# EAGLE design ASD2022 (EAGLE 6.3)
DATABASE: ./../../../../../Components/TinyCircuits_Part_Database.txt
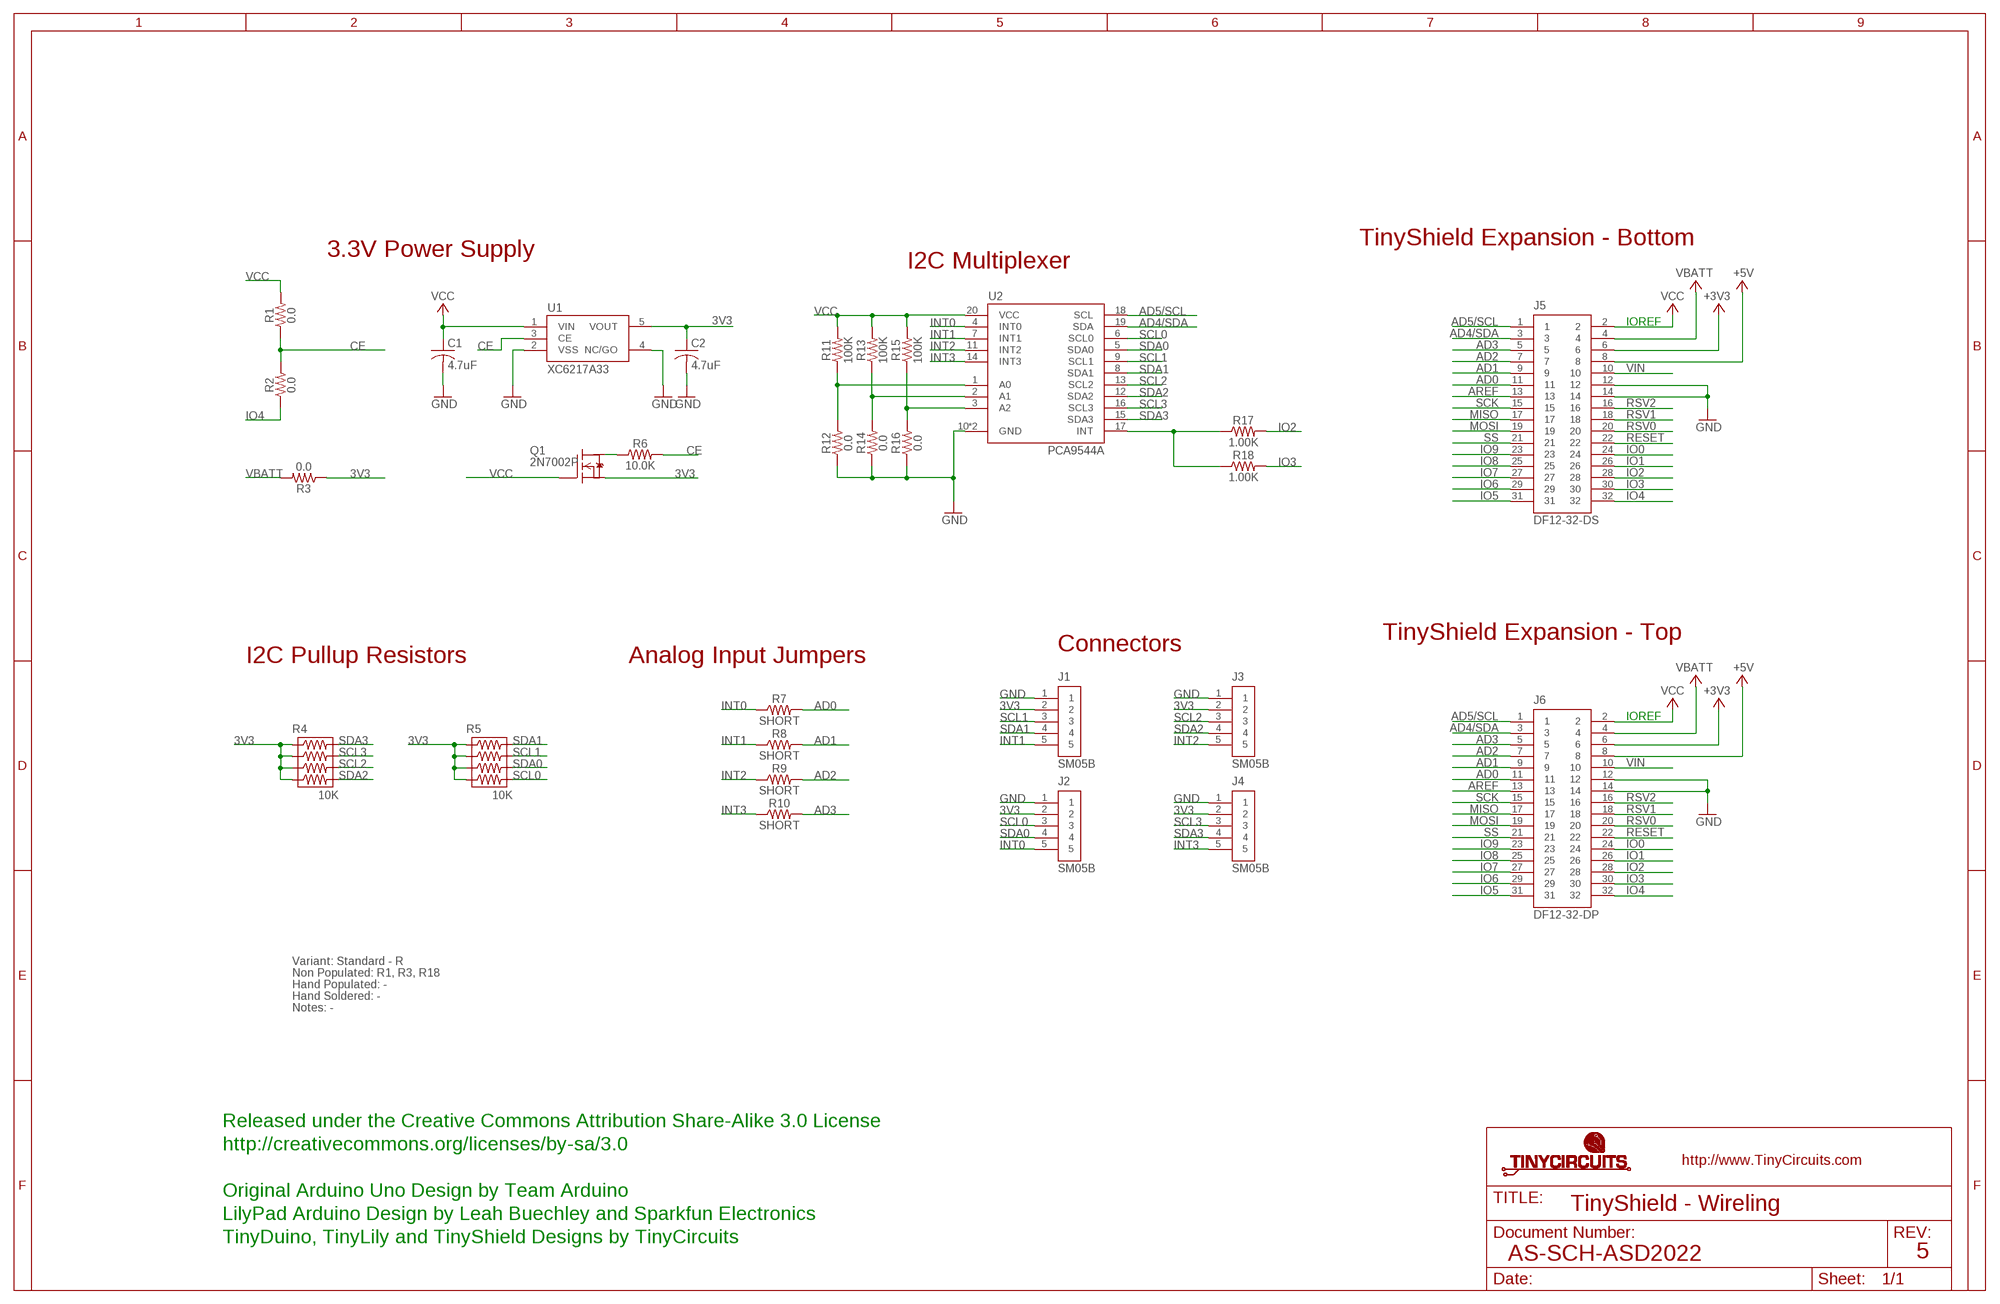
[diagram p0: schematic, sheet 1]

## Parts
C1  4.7uF  AS-ITM-00242  [C0402]
C2  4.7uF  AS-ITM-00242  [C0402]
J1  SM05B  AS-ITM-00340EDGE  [JST_SH_5X1_EDGE]
J2  SM05B  AS-ITM-00340EDGE  [JST_SH_5X1_EDGE]
J3  SM05B  AS-ITM-00340EDGE  [JST_SH_5X1_EDGE]
J4  SM05B  AS-ITM-00340EDGE  [JST_SH_5X1_EDGE]
J5  DF12-32-DS  AS-ITM-00012  [DF12-32-DS]
J6  DF12-32-DP  AS-ITM-00015  [DF12-32-DP]
Q1  2N7002P  AS-ITM-00110  [SOT-416]
R1  0.0  AS-ITM-00076  [0402]
R2  0.0  AS-ITM-00076  [0402]
R3  0.0  AS-ITM-00076  [0402]
R4  10K  AS-ITM-00520  [0402RPACK]
R5  10K  AS-ITM-00520  [0402RPACK]
R6  10.0K  AS-ITM-00032  [0402]
R7  SHORT  AS-ITM-000760402_SHORT  [0402_SHORT]
R8  SHORT  AS-ITM-000760402_SHORT  [0402_SHORT]
R9  SHORT  AS-ITM-000760402_SHORT  [0402_SHORT]
R10  SHORT  AS-ITM-000760402_SHORT  [0402_SHORT]
R11  100K  AS-ITM-00004  [0402]
R12  0.0  AS-ITM-00076  [0402]
R13  100K  AS-ITM-00004  [0402]
R14  0.0  AS-ITM-00076  [0402]
R15  100K  AS-ITM-00004  [0402]
R16  0.0  AS-ITM-00076  [0402]
R17  1.00K  AS-ITM-00003  [0402]
R18  1.00K  AS-ITM-00003  [0402]
U1  XC6217A33  AS-ITM-00249  [SOT-25]
U2  PCA9544A  AS-ITM-00342  [VQFN-20_4.5X3.5]

## Nets
3V3: C2.1 J1.2 J2.2 J3.2 J4.2 Q1.2(S) R3.1 R4.1 R4.3 R4.5 R4.7 R5.1 R5.3 R5.5 R5.7 U1.5(VOUT)
+3V3: J5.6 J6.6
+5V: J5.8 J6.8
AD0: J5.11 J6.11 R7.2
AD1: J5.9 J6.9 R8.2
AD2: J5.7 J6.7 R9.2
AD3: J5.5 J6.5 R10.2
AD4/SDA: J5.3 J6.3 U2.19(SDA)
AD5/SCL: J5.1 J6.1 U2.18(SCL)
AREF: J5.13 J6.13
CE: R1.1 R2.2 R6.2 U1.3(CE)
GND: C1.2 C2.2 J1.1 J2.1 J3.1 J4.1 J5.12 J5.14 J6.12 J6.14 R12.1 R14.1 R16.1 U1.2(VSS) U1.4(NC/GO) U2.10(GND) U2.PAD(GND)
INT0: J2.5 R7.1 U2.4(INT0)
INT1: J1.5 R8.1 U2.7(INT1)
INT2: J3.5 R9.1 U2.11(INT2)
INT3: J4.5 R10.1 U2.14(INT3)
IO0: J5.24 J6.24
IO1: J5.26 J6.26
IO2: J5.28 J6.28 R17.2
IO3: J5.30 J6.30 R18.2
IO4: J5.32 J6.32 R2.1
IO5: J5.31 J6.31
IO6: J5.29 J6.29
IO7: J5.27 J6.27
IO8: J5.25 J6.25
IO9: J5.23 J6.23
MISO: J5.17 J6.17
MOSI: J5.19 J6.19
N$1: Q1.3(D) R6.1
N$2: R11.1 R12.2 U2.1(A0)
N$3: R15.1 R16.2 U2.3(A2)
N$4: R17.1 R18.1 U2.17(INT)
N$6: R13.1 R14.2 U2.2(A1)
RESET: J5.22 J6.22
RSV0: J5.20 J6.20
RSV1: J5.18 J6.18
RSV2: J5.16 J6.16
SCK: J5.15 J6.15
SCL0: J2.3 R5.8 U2.6(SCL0)
SCL1: J1.3 R5.4 U2.9(SCL1)
SCL2: J3.3 R4.6 U2.13(SCL2)
SCL3: J4.3 R4.4 U2.16(SCL3)
SDA0: J2.4 R5.6 U2.5(SDA0)
SDA1: J1.4 R5.2 U2.8(SDA1)
SDA2: J3.4 R4.8 U2.12(SDA2)
SDA3: J4.4 R4.2 U2.15(SDA3)
SS: J5.21 J6.21
VBATT: J5.4 J6.4 R3.2
VCC: C1.1 J5.2 J6.2 Q1.1(G) R1.2 R11.2 R13.2 R15.2 U1.1(VIN) U2.20(VCC)
VIN: J5.10 J6.10

## Notes on the sheet
- TinyShield Expansion - Bottom
- 3.3V Power Supply
- I2C Multiplexer
- IOREF
- TinyShield Expansion - Top
- Connectors
- I2C Pullup Resistors | Analog Input Jumpers
- IOREF
- Variant: Standard - R
- Non Populated: R1, R3, R18
- Hand Populated: -
- Hand Soldered: -
- Notes: -
- Released under the Creative Commons Attribution Share-Alike 3.0 License
- http://creativecommons.org/licenses/by-sa/3.0
- Original Arduino Uno Design by Team Arduino
- TinyShield - Wireling
- LilyPad Arduino Design by Leah Buechley and Sparkfun Electronics
- TinyDuino, TinyLily and TinyShield Designs by TinyCircuits
- AS-SCH-ASD2022 | 5

## Library data of the parts
C1 C2 = tinycircuits:AS-ITM-00242: CAP CER 4.7UF 6.3V 20% X5R 0402; PARTNO: AS-ITM-00242
J1-J4 = tinycircuits:AS-ITM-00340: CONN HEADER SH 5POS SIDE 1MM TIN; PARTNO: AS-ITM-00340; PNPROTATION: 180
J5 = tinycircuits:AS-ITM-00012: CONN RECEPT 32POS 3MM SMD 0.5MM; PARTNO: AS-ITM-00012; PNPROTATION: 0
J6 = tinycircuits:AS-ITM-00015: CONN HEADER 32POS 3MM SMD 0.5MM; PARTNO: AS-ITM-00015; PNPROTATION: 0
Q1 = tinycircuits:AS-ITM-00110: MOSFET N-CH SGL 60V SOT-416; PARTNO: AS-ITM-00110; VALUE: 2N7002PT
R1-R3 R7-R10 R12 R14 R16 = tinycircuits:AS-ITM-00076: RES 0.0 OHM 1/16W 1% 0402 SMD; PARTNO: AS-ITM-00076
R4 R5 = tinycircuits:AS-ITM-00520: RES ARRAY 4 RES 10K OHM 0804; PARTNO: AS-ITM-00520
R6 = tinycircuits:AS-ITM-00032: RES 10.0K OHM 1/16W 1% 0402 SMD; PARTNO: AS-ITM-00032
R11 R13 R15 = tinycircuits:AS-ITM-00004: RES 100K OHM 1/16W 1% 0402; PARTNO: AS-ITM-00004
R17 R18 = tinycircuits:AS-ITM-00003: RES 1.00K OHM 1/16W 1% 0402; PARTNO: AS-ITM-00003
U1 = tinycircuits:AS-ITM-00249: IC REG LDO 3.3V 0.2A SOT25; PARTNO: AS-ITM-00249; PNPROTATION: 270
U2 = tinycircuits:AS-ITM-00342: IC I2C MUX 4CH BI-DIR 20-VQFN; PARTNO: AS-ITM-00342

## Board
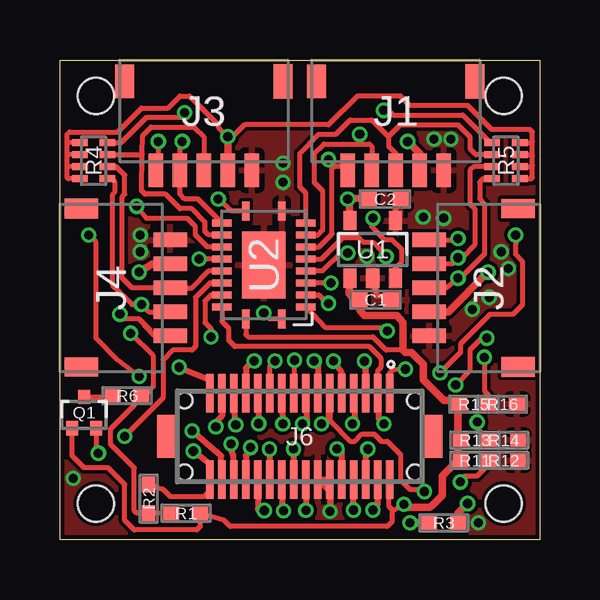
[diagram p1: board, top side]
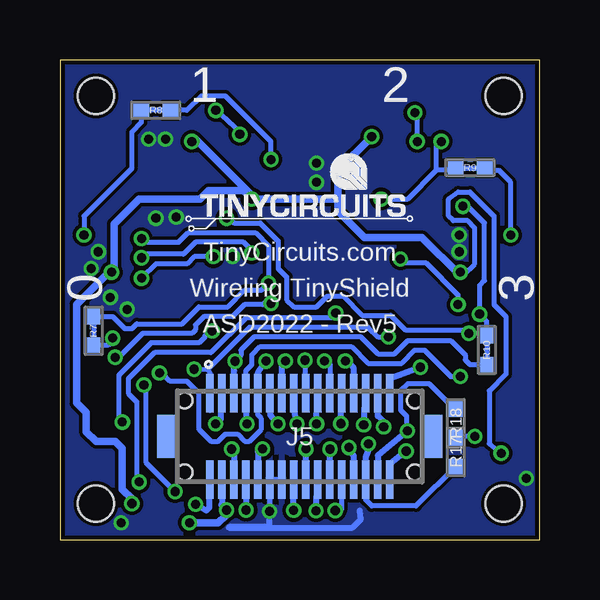
[diagram p2: board, bottom side, seen from below]

Size 20 x 20 mm. Coordinates in mm from the lower left corner, seen from the top.
Outline: 0,20 20,20 20,0 0,0 0,20
Copper layers (1*16): Top 0.035mm / dielectric 1.5mm / Bottom 0.035mm
Design rules "default *": minimum track width 5mil, minimum drill 15mil, track to track 6mil, track to pad 6mil, pad to pad 6mil, via to via 6mil, smd to smd 6mil, copper to edge 7mil, drill to drill 8mil, minimum pad ring 10mil, minimum via ring 5mil, stop-mask expansion 4mil, vias tented up to drill 25mil, thermal gap 10mil
Holes 1.5 mm at 1.5,18.5 18.5,18.5 18.5,1.5 1.5,1.5

### Footprints (pad centres in the part's own frame; a part is rotated, then mirrored left to right if it is on the bottom)
C0402 = smd 0.65 x 0.6: 1 -0.65,0; 2 0.65,0
JST_SH_5X1_EDGE = smd 0.6 x 1.4: 1 -2,2.475; 2 -1,2.475; 3 0,2.475; 4 1,2.475; 5 2,2.475 | smd 0.8 x 1.4: PAD1 -3.3,-1.225; PAD2 3.3,-1.225
DF12-32-DS = smd 0.3 x 1.6: 1 -3.75,1.8; 2 -3.75,-1.8; 3 -3.25,1.8; 4 -3.25,-1.8; 5 -2.75,1.8; 6 -2.75,-1.8; 7 -2.25,1.8; 8 -2.25,-1.8; 9 -1.75,1.8; 10 -1.75,-1.8; 11 -1.25,1.8; 12 -1.25,-1.8; 13 -0.75,1.8; 14 -0.75,-1.8; 15 -0.25,1.8; 16 -0.25,-1.8; 17 0.25,1.8; 18 0.25,-1.8; 19 0.75,1.8; 20 0.75,-1.8; 21 1.25,1.8; 22 1.25,-1.8; 23 1.75,1.8; 24 1.75,-1.8; 25 2.25,1.8; 26 2.25,-1.8; 27 2.75,1.8; 28 2.75,-1.8; 29 3.25,1.8; 30 3.25,-1.8; 31 3.75,1.8; 32 3.75,-1.8 | smd 0.9 x 1.8: F1 -5.5,0; F2 5.5,0 | hole 0.65: -4.8,1.5; 4.8,1.5
DF12-32-DP = smd 0.3 x 1.6: 1 -3.75,-1.8; 2 -3.75,1.8; 3 -3.25,-1.8; 4 -3.25,1.8; 5 -2.75,-1.8; 6 -2.75,1.8; 7 -2.25,-1.8; 8 -2.25,1.8; 9 -1.75,-1.8; 10 -1.75,1.8; 11 -1.25,-1.8; 12 -1.25,1.8; 13 -0.75,-1.8; 14 -0.75,1.8; 15 -0.25,-1.8; 16 -0.25,1.8; 17 0.25,-1.8; 18 0.25,1.8; 19 0.75,-1.8; 20 0.75,1.8; 21 1.25,-1.8; 22 1.25,1.8; 23 1.75,-1.8; 24 1.75,1.8; 25 2.25,-1.8; 26 2.25,1.8; 27 2.75,-1.8; 28 2.75,1.8; 29 3.25,-1.8; 30 3.25,1.8; 31 3.75,-1.8; 32 3.75,1.8 | smd 0.9 x 1.8: F1 -5.5,0; F2 5.5,0 | hole 0.65: -4.8,1.5; 4.8,1.5
SOT-416 = smd 0.5 x 0.6: 1 -0.5,-0.65; 2 0.5,-0.65; 3 0,0.65
0402 = smd 0.65 x 0.55: 1 -0.6,0; 2 0.6,0
0402RPACK = smd 0.3 x 0.65: 1 -0.75,0.575; 2 -0.75,-0.575; 3 -0.25,0.575; 4 -0.25,-0.575; 5 0.25,0.575; 6 0.25,-0.575; 7 0.75,0.575; 8 0.75,-0.575
0402_SHORT = smd 0.65 x 0.55: 1 -0.6,0; 2 0.6,0
SOT-25 = smd 0.55 x 0.8: 1 -0.95,-1.2; 2 0,-1.2; 3 0.95,-1.2; 4 0.95,1.2; 5 -0.95,1.2
VQFN-20_4.5X3.5 = smd 0.8 x 0.3: 1 -2.25,-0.75; 10 2.25,-0.75; 11 2.25,0.75; 20 -2.25,0.75 | smd 0.3 x 0.8: 2 -1.75,-1.75; 3 -1.25,-1.75; 4 -0.75,-1.75; 5 -0.25,-1.75; 6 0.25,-1.75; 7 0.75,-1.75; 8 1.25,-1.75; 9 1.75,-1.75; 12 1.75,1.75; 13 1.25,1.75; 14 0.75,1.75; 15 0.25,1.75; 16 -0.25,1.75; 17 -0.75,1.75; 18 -1.25,1.75; 19 -1.75,1.75 | smd 2.8 x 1.8: PAD 0,0

### Placement (x,y rotation side)
C1  13.15,10 0 top
C2  13.55,14.2 0 top
J1  14,17.88 180 top
J2  17.88,10.5 90 top
J3  6,17.88 180 top
J4  2.12,10.5 270 top
J5  10,4.3 0 bottom
J6  10,4.3 180 top
Q1  1,5.3 0 top
R1  5.25,1.1 0 top
R2  3.7,1.7 270 top
R3  16,0.7 180 top
R4  1.4,15.8 90 top
R5  18.6,15.8 270 top
R6  2.8,6 0 top
R7  18.6,8.7 270 bottom
R8  16,17.9 180 bottom
R9  2.9,15.5 0 bottom
R10  2.2,7.9 270 bottom
R11  17.3,3.3 180 top
R12  18.5,3.3 180 top
R13  17.3,4.15 180 top
R14  18.5,4.15 180 top
R15  17.25,5.65 180 top
R16  18.45,5.65 180 top
R17  3.5,3.65 270 bottom
R18  3.5,4.85 90 bottom
U1  13.04,12.1 0 top
U2  8.5,11.45 90 top
U$1  [DOCFIELD-TINYCIRCUITS-PCB]  33.91,-10 0 top  (outside the outline)

### Tracks (layer width: path | path; a pad name or v marks a point on that pad's centre or on a via)
3V3  (via drill 0.38)
  Top 0.203: R4.1 0.35,15.05 0.3,15.1 0.3,15.5 | 0.3,15.5 0.3,16 | 0.3,16 0.3,16.5 | R4.7 0.35,16.55 0.3,16.5 | R4.5 0.35,16.05 0.3,16 | R4.3 0.35,15.55 0.3,15.5 | 0.3,16.5 0.3,16.9 0.4,17 2.4,17 3.4,18 4.5,18 5,18.5 5.4,18.5 6.6,17.3 6.6,17.2 v7,16.8 7.2,16.8 7.7,17.3 11.2,17.3 12.4,18.5 14.2,18.5 14.6,18.1 17,18.1 18,17.1 19.6,17.1 19.7,17 19.7,16.6 | R5.7 19.65,15.05 19.7,15.1 19.7,15.6 | 19.7,15.6 19.7,16 | 19.7,16 19.7,16.6 | R5.5 19.65,15.55 19.7,15.6 | R5.3 19.65,16.05 19.7,16 | R5.1 19.65,16.55 19.7,16.6 | Q1.2 1.5,3.7 v1.6,3.6
  Top 0.305: U1.5 12.04,14.16 v12,14.2 12.05,14.25 C2.1 | v3.3,11.15 3.85,11.5 J4.2 | v7,16.8 J3.2 | J1.2 15,16.1 v14.5,16.6 | J2.2 16.2,9.5 v17.85,11.15 | R3.1 16.6,1.1 v17,1.5
  Bottom 0.203: 3.35,11.05 3.15,11.05 2.7,11.5 2.7,13 3,13.3 3.6,13.3 3.8,13.5 3.8,14.2 3.4,14.5 2.9,14.5 1.9,13.5 1.9,9.8 1.4,9.3 1.4,6.9 2.1,6.2 2.1,4 v1.6,3.6
  Bottom 0.305: v12,14.2 8.4,14.2 | 8.4,14.2 8.4,13.7 7.3,12.6 4.9,12.6 3.35,11.05 v3.3,11.15 | 8.4,14.2 8.4,15.4 v7,16.8 | v14.5,16.6 14.55,16.65 14.3,16.65 12,14.35 v12,14.2 | v17.85,11.15 17.8,11.1 17.75,11.15 | v17.85,11.15 17.75,11.15 | 17.75,11.15 17.75,13.15 16.7,14.2 14.15,14.2 13.8,14.55 12.35,14.55 v12,14.2 | v17,1.5 17,1.7 17.4,2.1 17.4,3.8 17.7,4.1 18.5,4.1 18.9,4.5 18.9,5.3 19.3,5.7 19.3,9.8 18.05,11.05 v17.85,11.15
+3V3  (via drill 0.38)
  Top 0.254: J5.6 12.75,3.77 v12.84,3.77
  Bottom 0.254: v12.84,3.77 12.8,3.7 12.74,3.64 12.74,2.51 J5.6
+5V  (via drill 0.38)
  Top 0.254: v12.24,1.23 J5.8
  Bottom 0.254: J5.8 12.25,1.21 v12.24,1.23
AD0  (via drill 0.38)
  Top 0.203: J5.11 11.25,4.95 12.1,4.1 12.3,4.1 12.6,4.4 13.1,4.4 13.4,4.1 13.65,4.1 14.2,3.55 14.2,2.5 14.6,2.1 15.1,2.1 | 15.15,2.1 15.1,2.1 | 15.1,2.1 v15.2,2 | v16.5,6.45 17.1,7.05 17.1,7.9 17.6,8.4 v17.8,8.4
  Top 0.254: v10.9,4.83 11.21,5.05 J5.11
  Bottom 0.203: v15.2,2 16.4,3.2 16.4,6.4 | 16.4,6.6 16.4,6.4 | 16.4,6.4 v16.5,6.45 | v17.8,8.4 17.8,8.3 18,8.1 R7.2
  Bottom 0.254: J5.11 11.23,5.79 11.23,5.18 11,4.9 v10.9,4.83
AD1  (via drill 0.38)
  Top 0.203: v15.85,6.95 16.7,7.8 16.7,8.15 17.95,9.4 18.9,9.4 19.3,9.8 19.3,11.6 19,11.9 v19,12.7 19,12.3
  Top 0.254: J5.9 11.74,6.97 v11.41,7.44
  Bottom 0.203: J5.9 11.75,5.2 11.6,5.05 11.6,4.6 12.1,4.1 12.3,4.1 12.6,4.4 13.1,4.4 13.4,4.1 13.7,4.1 14.2,4.6 14.2,6.1 14.7,6.6 15.4,6.6 15.75,6.95 v15.85,6.95 | v19,12.7 19,13.5 17,15.5 17,17 16.6,17.4 R8.2
  Bottom 0.254: v11.41,7.44 11.73,6.97 J5.9
AD2  (via drill 0.38)
  Top 0.203: v3.3,6.8 2.4,7.5 1.5,8.4 1.5,12.4 v1.2,12.7
  Top 0.254: v12.19,4.83 12.31,5.05 J5.7
  Bottom 0.203: J5.7 12.25,7.05 12,7.3 12,7.7 11.65,8.05 7.85,8.05 7.15,7.35 5.75,7.35 5.2,7.9 4.8,7.9 3.7,6.8 v3.3,6.8 | v1.2,12.7 1.2,14.9 1.7,15.4 2.2,15.4 R9.2
  Bottom 0.254: J5.7 12.27,5.86 v12.19,4.83
AD3  (via drill 0.38)
  Top 0.254: J5.5 12.73,7.04 v12.7,7.44
  Bottom 0.203: v12.7,7.44 12.45,7.68 12.45,7.9 11.9,8.45 7.45,8.45 6.75,7.75 6.05,7.75 5.5,8.3 3.7,8.3 3.1,7.7 3.1,7.5 2.9,7.3 R10.2
  Bottom 0.254: v12.7,7.44 12.73,7.05 J5.5
AD4/SDA  (via drill 0.38)
  Top 0.203: U2.19 6.75,9.1 7.05,8.8 7.05,8.3 7.3,8.05 12.9,8.05 13.4,7.55 13.4,7.2 13.25,7.05 J5.3
  Top 0.254: v13.51,4.83 13.31,5 J5.3
  Bottom 0.254: J5.3 13.28,5.86 13.28,5.02 13.4,4.9 v13.51,4.83
AD5/SCL  (via drill 0.38)
  Top 0.203: 13.75,5.37 J5.1 13.75,6.95 13.9,7.1 v14.41,7.11 | U2.18 6.3,10.2 6.05,9.95 6.05,9.05 6.3,8.8 v6.3,8.45
  Bottom 0.203: v14.41,7.11 13.85,7.1 | 13.85,7.1 13.75,6.95 J5.1 | 13.75,5.37 J5.1 | J5.1 | v6.3,8.45 6.75,8.45 7.15,8.85 12.1,8.85 13.85,7.1
AREF  (via drill 0.38)
  Top 0.254: v10.6,7.45 10.7,7.4 10.75,7.35 J5.13
  Bottom 0.254: J5.13 10.75,7.35 10.7,7.4 v10.6,7.45
CE  (via drill 0.38)
  Top 0.203: U1.3 13.99,11.34 14.25,11.6 14.25,12.1 13.85,12.5 13.55,12.5 13,13.05 v13.05,13.4 | R1.1 R2.2 3.2,1.1 3.1,1.2 3.1,3 2.1,4 2.1,4.6 3.1,5.6 3.1,5.7 R6.2 3.5,6 3.9,6.4 3.9,7.65 v2.95,8.6 3.1,8.45
  Bottom 0.203: v13.05,13.4 12.85,13.3 12.75,13.2 11.65,13.2 10.9,12.45 10.9,11.3 10.55,10.95 10.55,10 10.25,9.7 9.3,9.7 8.85,10.15 8.2,10.15 7.4,9.35 6.2,9.35 5.6,8.75 3.15,8.75 3,8.6 v2.95,8.6
GND  (via drill 0.38)
  Top 0.203: J5.12 v11.26,1.17 | 11.3,1.95 11.3,1.14 | 11.3,1.14 11.29,1.13 11.29,1.09 | J5.14 11.27,1.97 11.27,1.93 11.22,1.87 11.27,1.16 11.28,1.07 11.28,1.03 11.3,1.01 11.37,1.01 | 11.3,1.14 11.3,1.01 | U1.4 13.94,13.64 14,13.7 14.05,14 C2.2 | C1.2 13.65,10.15 13.2,10.15 13.2,10.4 13.04,10.56 U1.2
  Top 0.254: J5.12 J5.14
  Bottom 0.203: v11.26,1.17 11.25,1.21 J5.12
  Bottom 0.254: J5.12 J5.14 | 7.5,1.2 7.45,0.85 7.8,0.5 12.95,0.5 12.9,0.55 11.25,0.55 11.26,0.56 v11.26,1.17
  other vias: 17.45,0.7 0.55,2.55 3.35,12.7 3.35,12 17.2,9.6 15.6,16.7 12.8,11.8 16.3,16.7 15.15,13.45 16,13.4 9.3,14.9 9.3,15.7 18.7,11.3 18.4,12 17.9,10.1
  pour Top: 0,0 20,0 20,20 0,20
  pour Bottom: 0,20 20,20 20,0 0,0
INT0  (via drill 0.38)
  Top 0.203: J2.5 16.5,12.5 v16.6,12.55 | v11.3,10.7 U2.4
  Bottom 0.203: v16.6,12.55 16.55,12.55 16.4,12.4 15.05,12.4 14.65,12.8 11.85,12.8 11.3,12.25 v11.3,10.7 11.6,10.4 12.3,10.4 13,9.7 14.2,9.7 14.9,9 16.8,9 17,8.8 17.3,8.8 17.8,9.3 R7.1
INT1  (via drill 0.38)
  Top 0.203: U2.7 10.8,12.2 11.35,12.75 11.35,15.65 | J1.5 11.85,15.55 11.45,15.55 11.35,15.65 | 11.35,15.65 11.2,15.8 v11.2,15.85 11.35,15.65
  Bottom 0.203: v11.2,15.85 11.2,16.6 13.1,18.5 14.1,18.5 14.7,17.9 R8.1
INT2  (via drill 0.38)
  Top 0.203: U2.11 7.15,13.7 v6.6,14.2 | v4.1,16.6 4.1,15.5 J3.5
  Bottom 0.203: v6.6,14.2 5.5,14.2 4.3,15.4 | 4.3,15.4 4.3,16.4 v4.1,16.6 | R9.1 3.6,15.4 4.3,15.4
INT3  (via drill 0.38)
  Top 0.203: U2.14 6.15,12.2 5.65,12.7 5.65,13.05 5.3,13.4 3.6,13.4 v3.2,13.9 | J4.5 3.95,8.5 3.55,8.9 3.75,8.75 3.3,9.2 2.7,9.2 v2.5,9.4
  Bottom 0.203: 3.3,13.8 v3.2,13.9 3.1,14 2.3,13.2 2.3,10.8 2.5,10.6 v2.5,9.4 2.2,9.1 R10.1
IO0  (via drill 0.38)
  Top 0.254: J5.24 8.25,1.26 v8.52,1.21
  Bottom 0.203: v8.52,1.21 8.48,1.27 8.25,1.27 J5.24
  Bottom 0.254: J5.24
IO1  (via drill 0.38)
  Top 0.254: v7.95,3.84 7.95,3.7 7.75,3.5 J5.26
  Bottom 0.254: J5.26 7.75,3.5 7.95,3.7 v7.95,3.84
IO2  (via drill 0.38)
  Top 0.254: v7.13,3.99 7.07,3.89 7.22,3.49 7.29,2.61 7.26,2.51 J5.28
  Bottom 0.203: R17.2 5.15,1.4 7,1.4 7.25,1.65 J5.28
  Bottom 0.254: J5.28 7.24,3.43 7.07,3.88 v7.13,3.99
IO3  (via drill 0.38)
  Top 0.254: J5.30 6.73,3.49 v5.51,4.53
  Bottom 0.203: 5.51,4.71 v5.51,4.53 5.55,4.57 5.55,5.15 5.8,5.4 5.8,6.2 5.5,6.5 4.6,6.5 3.55,5.45 R18.2
  Bottom 0.254: v5.51,4.53 6.75,3.51 6.77,2.53 J5.30
IO4  (via drill 0.38)
  Top 0.203: R2.1 4.3,2.1 4.6,1.8 6,1.8 6.25,2.05 J5.32
  Top 0.254: J5.32 6.25,3.14 v5.56,3.69
  Bottom 0.254: v5.56,3.69 5.61,3.65 6.21,3.18 6.21,3.14 6.26,3.1 J5.32
IO5  (via drill 0.38)
  Top 0.254: v4.97,7.19 6.23,6.68 J5.31
  Bottom 0.254: J5.31 6.26,6.69 v4.97,7.19
IO6  (via drill 0.38)
  Top 0.254: J5.29 6.75,5.15 6.3,4.7 v6.5,4.7
  Bottom 0.203: 6.74,6.11 J5.29
  Bottom 0.254: v6.5,4.7 6.3,4.7 6.75,5.15 J5.29
IO7  (via drill 0.38)
  Top 0.254: v7.33,4.78 7.31,4.9 J5.27
  Bottom 0.254: J5.27 7.29,5.76 v7.33,4.78
IO8  (via drill 0.38)
  Top 0.203: 7.76,6.11 J5.25
  Top 0.254: v8.1,7.45 8,7.4 7.75,7.15 J5.25
  Bottom 0.254: J5.25 7.75,7.15 8,7.4 v8.1,7.45
IO9  (via drill 0.38)
  Top 0.254: v8.29,4.83 8.31,4.98 J5.23
  Bottom 0.254: J5.23 8.28,5.59 v8.29,4.83
MISO  (via drill 0.38)
  Top 0.203: v9.78,7.48 9.75,7.46 J5.17
  Bottom 0.203: J5.17 9.76,6.11 9.76,7.17 9.73,7.3 v9.78,7.48
MOSI  (via drill 0.38)
  Top 0.254: v9.3,4.83 9.31,4.95 J5.19
  Bottom 0.254: J5.19 9.27,5.76 v9.3,4.83
N$1
  Top 0.203: Q1.3 2.15,5.95 R6.1
N$2  (via drill 0.38)
  Top 0.203: U2.1 8.75,9.2 v8.5,9.45 | v16.7,2.4 16.9,2.65 17.4,2.65 17.9,3.15 R11.1
  Bottom 0.203: v8.5,9.45 8.65,9.25 12.25,9.25 13.7,7.8 16.05,7.8 17.15,6.7 17.15,6.1 16.8,5.75 16.8,2.5 v16.7,2.4
N$3  (via drill 0.38)
  Top 0.203: U2.3 10.8,10.2 11,10 11.05,10 v11.2,9.85 | v17.7,7.6 17.7,6.2 17.85,6.05 R15.1
  Bottom 0.203: v11.2,9.85 11.5,9.85 11.55,9.8 12.3,9.8 12.8,9.3 14,9.3 14.35,8.95 14.35,8.75 14.5,8.6 16.55,8.6 17.55,7.6 v17.7,7.6
N$4  (via drill 0.38)
  Top 0.203: U2.17 6.25,10.7 5.65,10.1 5.65,8.05 5.5,7.9 4.7,7.9 4.3,7.5 4.3,5.9 v2.7,4.3
  Bottom 0.203: v2.7,4.3 3.45,4.3 R17.1
N$6  (via drill 0.38)
  Top 0.203: U2.2 11.05,8.85 13.5,8.85 v13.65,8.7 | v17.4,4.9 17.35,4.7 R13.1
  Bottom 0.203: v13.65,8.7 13.8,8.55 13.9,8.55 13.95,8.5 13.95,8.45 14.2,8.2 16.2,8.2 17.55,6.85 17.55,5 v17.4,4.9
RESET  (via drill 0.38)
  Top 0.254: v8.74,3.77 J5.22
  Bottom 0.254: J5.22 8.75,3.69 v8.74,3.77
RSV0  (via drill 0.38)
  Top 0.254: J5.20 9.25,1.2 v9.32,1.2
  Bottom 0.254: v9.32,1.2 J5.20
RSV1  (via drill 0.38)
  Top 0.254: v9.74,3.77 9.74,2.51 J5.18
  Bottom 0.254: J5.18 9.75,3.72 v9.74,3.77
RSV2  (via drill 0.38)
  Top 0.254: J5.16 10.25,1.16 v10.25,1.22
  Bottom 0.254: v10.25,1.22 J5.16
SCK  (via drill 0.38)
  Top 0.254: v10.11,4.83 10.31,4.98 J5.15
  Bottom 0.254: J5.15 10.29,5.66 v10.11,4.83
SCL0  (via drill 0.38)
  Top 0.203: J2.3 16.1,10.5 v16.6,10.9 16.7,10.9 17.7,11.9 17.7,14 17.5,14.2 17.5,14.9 17.65,15.05 R5.8 | U2.6 10.9,11.7 11.8,12.6 12.45,12.6 12.65,12.4 13.05,12.4 13.45,12 v13.6,11.8
  Bottom 0.203: 16.6,10.85 v16.6,10.9 16,11.5 14.7,11.5 14.4,11.8 v13.6,11.8
SCL1
  Top 0.203: U2.9 10.25,14.45 10,14.7 10,16.1 10.8,16.9 11.5,16.9 12.1,17.5 13,17.5 13.7,16.8 | J1.3 14,16.1 13.7,16.4 13.7,16.8 | 13.7,16.8 14.2,17.3 16.6,17.3 17.1,16.8 17.1,16.3 17.35,16.05 R5.4
SCL2
  Top 0.203: U2.13 6.2,12.7 6.05,12.85 6.05,13.25 5.5,13.8 5,13.8 4.4,14.4 3.55,14.4 3.4,14.55 3.43,16.09 | 3.43,16.09 3.45,16.85 3.8,17.2 5.6,17.2 6,16.8 J3.3 | R4.6 3.39,16.05 3.43,16.09
SCL3
  Top 0.203: U2.16 6.2,11.2 5.5,10.5 J4.3 3,10.5 2.7,10.8 2.6,10.9 2.6,14.3 2.7,14.4 2.7,15.2 2.35,15.55 R4.4
SDA0  (via drill 0.38)
  Top 0.203: U2.5 10.95,11.2 11.75,12 11.95,12 v12,11.95 | J2.4 16.35,11.5 v16.6,11.75 16.75,11.75 17.3,12.3 17.3,13.8 17.1,14 17.1,15.4 17.25,15.55 R5.6
  Bottom 0.203: v16.6,11.75 16.4,11.9 14.85,11.9 14.35,12.4 12.35,12.4 12.1,12.15 12.1,11.95 v12,11.95
SDA1  (via drill 0.38)
  Top 0.203: U2.8 10.75,12.7 10.95,12.9 10.95,14.55 10.6,14.9 10.6,16.1 11,16.5 12.5,16.5 | 12.5,16.5 12.9,16.5 13,16.4 J1.4 | v13.5,17.9 13.7,17.9 13.9,17.7 16.8,17.7 17.95,16.55 R5.2 | v12.5,16.9 12.5,16.5
  Bottom 0.203: v12.5,16.9 12.5,17 v13.5,17.9
SDA2  (via drill 0.38)
  Top 0.203: U2.12 5.75,14.2 5.2,14.2 5,14.4 J3.4 5,16.5 v5.1,16.6 | v5.2,17.8 5,17.6 3.6,17.6 2.55,16.55 R4.8
  Bottom 0.203: v5.1,16.6 5.1,17.7 v5.2,17.8
SDA3  (via drill 0.38)
  Top 0.203: U2.15 v5.8,11.7 5.75,11.55 | J4.4 3.7,9.5 v3.4,9.8 3,9.8 2.3,10.5 2.2,10.6 2.2,14.4 2.3,14.5 2.3,14.9 2.15,15.05 R4.2
  Bottom 0.203: v5.8,11.7 5.8,11.6 5.75,11.55 4.75,11.55 3.4,10.2 v3.4,9.8
SS  (via drill 0.38)
  Top 0.203: J5.21 8.77,6.12 8.77,7.27 8.9,7.4 v8.97,7.45
  Bottom 0.203: v8.97,7.45 8.75,7.33 J5.21
VBATT  (via drill 0.38)
  Top 0.254: v13.05,1.23 13.1,1.3 13.25,1.45 J5.4
  Top 0.305: v14.6,0.7 R3.2
  Bottom 0.254: J5.4 13.25,1.44 v13.05,1.23
  Bottom 0.305: 13.25,1.44 13.1,1.29 13.1,1 13.4,0.7 v14.6,0.7
VCC  (via drill 0.38)
  Top 0.203: v14.35,1.47 13.9,1.2 | 13.9,1.2 13.73,1.38 13.73,2.67 J5.2 | U2.20 7.75,8.55 7.85,8.45 13.05,8.45 13.6,7.9 14.3,7.9 | R11.2 16.6,3.4 | R13.2 16.6,4.15 | R15.2 16.6,5.5 | 13.9,1.2 13.85,1.15 13.85,0.75 13.65,0.55 7.1,0.55 6.85,0.8 R1.2 5.85,0.55 5.7,0.4 3.1,0.4 2.7,0.8 2.7,2.3 2,3 1,3 0.5,3.5 Q1.1
  Top 0.305: U1.1 12.04,10.26 12.2,10.1 C1.1 12.5,9.55 12.7,9.35 14.05,9.35 14.3,9.05 14.3,7.9 14.4,7.8 14.65,7.8 15.15,7.3 15.15,6.65 16,5.8 16.45,5.8 16.6,5.65 16.6,5.5 16.6,4.15 16.6,3.4 16.6,3.3 15.95,2.65 15.95,1.85 15.5,1.4 15.4,1.35 14.5,1.35 14.4,1.52 v14.35,1.47
  Bottom 0.203: J5.2 13.77,2.45
  Bottom 0.254: 13.77,2.45 13.77,1.33 13.9,1.2 v14.35,1.47
VIN  (via drill 0.38)
  Top 0.254: J5.10 11.76,3.78 v11.55,3.78
  Bottom 0.254: v11.55,3.78 11.6,3.8 11.74,3.66 J5.10

### Text on the board
bPlace: 2 | 1 | TinyCircuits.com | 3 | Wireling TinyShield | 0 | ASD2022 - Rev5
Document: FABRICATION DRAWING | NOTES: | 1. PRINTED CIRCUIT BOARD MADE FROM NEMA GRADE FR-4 EPOXY LAMINATE | WITH 1 OUNCE COPPER PLATING AND .024 THICKNESS. | 2. ALL DIMENSIONS ARE GIVEN IN INCHES. | 3. CIRCUIT PATHS ARE FOR REFERENCE ONLY. | 4. HOLE SIZES SHOWN ARE FINISHED DIAMETERS AFTER PLATING. | 5. BOARD PLATED USING REFLOW OR SIMILAR METHOD. | 6. BOARD TO HAVE BLUE SOLDER MASK ON PLATED SURFACES USING WET FILM | 7. SILKSCREEN BOARD USING WHITE INK. | SR100 OR SR1010 EPOXY. EQUIVALENT WET OR DRY FILM MAY BE USED. | 8. THE FOLLOWING INFORMATION APPLIES TO THIS BOARD: | * 2 COPPER LAYERS | * .024 BOARD THICKNESS | * REQUIRES TOP SIDE SILKSCREEN | Released under the Creative Commons Attribution Share-Alike 3.0 License | http://creativecommons.org/licenses/by-sa/3.0 | Original Arduino Uno Design by Team Arduino | LilyPad Arduino Design by Leah Buechley and Sparkfun Electronics | TinyDuino, TinyLily and TinyShield Designs by TinyCircuits | TinyShield - Wireling | AS-PCB-ASD2022 | 5